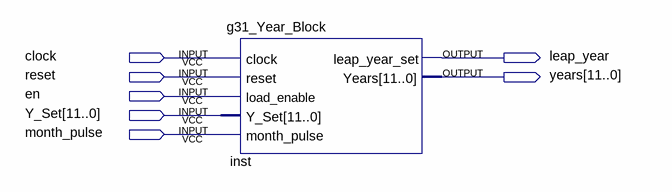
[diagram p0: schematic sheet]
// Quartus schematic g31_year_counter.bdf as structural Verilog: 1 symbols, 7 pins
module g31_year_counter (
  input  clock,
  input  reset,
  input  en,
  input  [11:0] Y_Set,
  input  month_pulse,
  output leap_year,
  output [11:0] years
);

  g31_Year_Block inst (
    .clock(clock), .reset(reset), .load_enable(en), .Y_Set(Y_Set), .month_pulse(month_pulse),
    .leap_year_set(leap_year), .Years(years));
endmodule
